# Altium schematic sheet ESP_32_devolpment_board_schematic.SchDoc
size 381 x 241 mm; SheetNumber: 1; SheetTotal: 1; Rule: UNIONINDEX=0|RULEKIND=Clearance|NETSCOPE=DifferentNets|LAYERKIND=SameLayer|NAME=Schematic Clearance Constraint|GAP=10mil|GENERICCLEARANCE=10mil|IGNOREPADTOPADCLEARANCEINFOOTPRINT=FALSE|OBJECTCLEARANCES= |UNIT=Metric; Rule: UNIONINDEX=0|RULEKIND=Clearance|NETSCOPE=DifferentNets|LAYERKIND=SameLayer|NAME=Schematic Clearance Constraint|GAP=10mil|GENERICCLEARANCE=10mil|IGNOREPADTOPADCLEARANCEINFOOTPRINT=FALSE|OBJECTCLEARANCES= |UNIT=Imperial
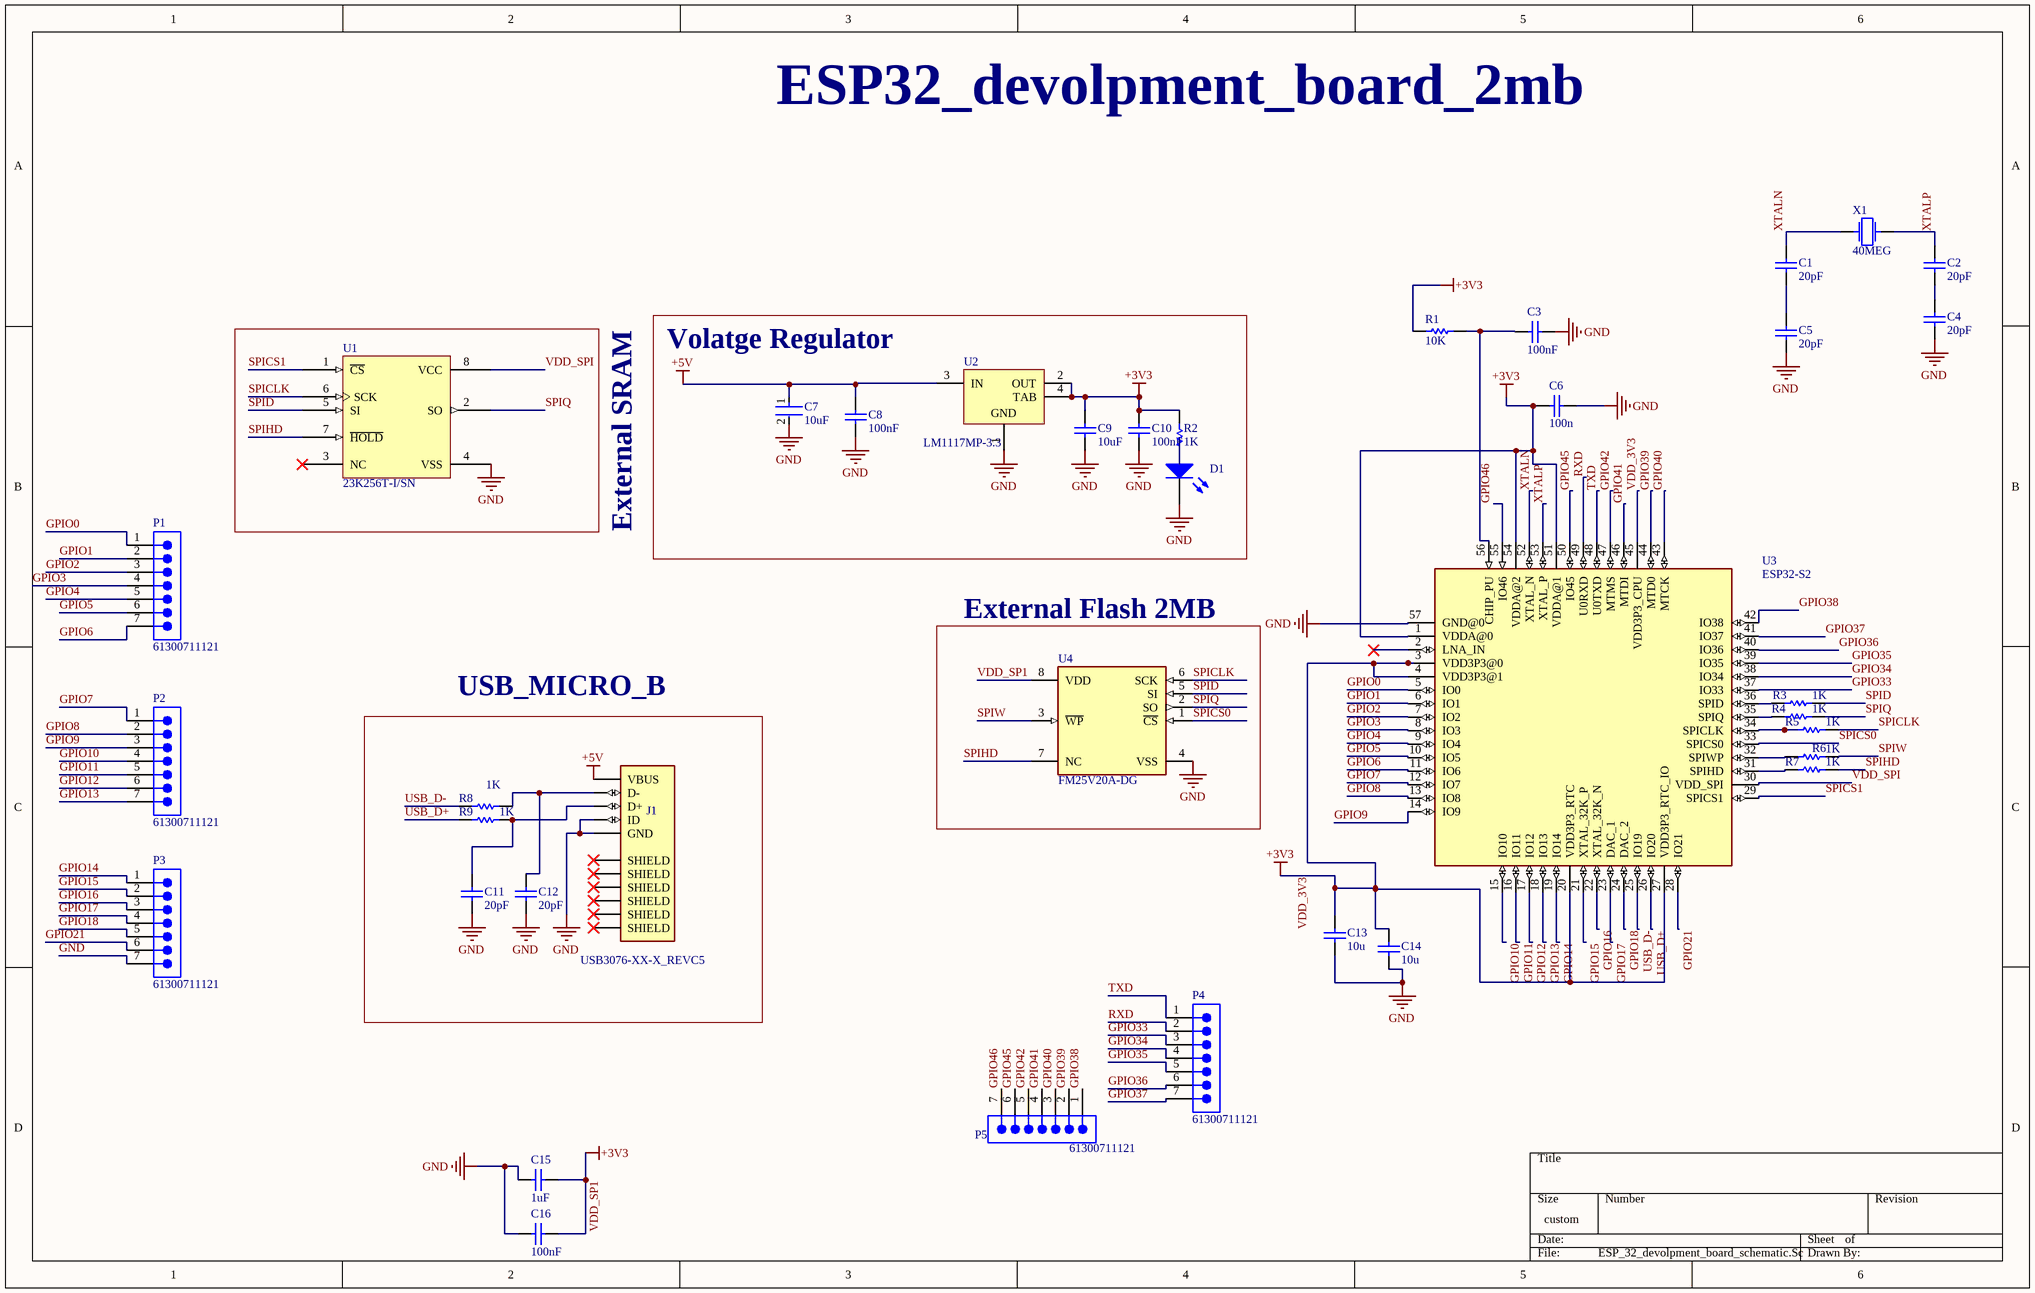
[diagram p0: ESP_32_devolpment_board_schematic.SchDoc]

## Parts
C1  value 20pF  [C Tantal A]  (hidden comment: Capacitor)
C2  value 20pF  [C Tantal A]  (hidden comment: Capacitor)
C3  value 100nF  [C Tantal A]  (hidden comment: Capacitor)
C4  value 20pF  [C Tantal A]  (hidden comment: Capacitor)
C5  value 20pF  [C Tantal A]  (hidden comment: Capacitor)
C6  value 100n  [C Tantal A]  (hidden comment: Capacitor)
C7  10uF  [FP-GRM188-0_1-e0_2_0_55-IPC_A]
C8  value 100nF  [C Tantal A]  (hidden comment: Capacitor)
C9  value 10uF  [C Tantal A]  (hidden comment: Capacitor)
C10  value 100nF  [C Tantal A]  (hidden comment: Capacitor)
C11  value 20pF  [C Tantal A]  (hidden comment: Capacitor)
C12  value 20pF  [C Tantal A]  (hidden comment: Capacitor)
C13  value 10u  [C Tantal A]  (hidden comment: Capacitor)
C14  value 10u  [C Tantal A]  (hidden comment: Capacitor)
C15  value 1uF  [C Tantal A]  (hidden comment: Capacitor)
C16  value 100nF  [C Tantal A]  (hidden comment: Capacitor)
D1  Light-Emitting Diode  [LED0805]  (value not drawn)
J1  USB3076-XX-X_REVC5  [GCT_USB3076-XX-X_REVC5]
P1  61300711121  [61300711121]
P2  61300711121  [61300711121]
P3  61300711121  [61300711121]
P4  61300711121  [61300711121]
P5  61300711121  [61300711121]
R1  value 10K  [R0805]  (hidden comment: Resistor)
R2  value 1K  [R0805]  (hidden comment: Resistor)
R3  value 1K  [R0805]  (hidden comment: Resistor)
R4  value 1K  [R0805]  (hidden comment: Resistor)
R5  value 1K  [R0805]  (hidden comment: Resistor)
R6  value 1K  [R0805]  (hidden comment: Resistor)
R7  value 1K  [R0805]  (hidden comment: Resistor)
R8  value 1K  [R0805]  (hidden comment: Resistor)
R9  value 1K  [R0805]  (hidden comment: Resistor)
U1  23K256T-I/SN  [SOIC-SN8_L]
U2  LM1117MP-3.3  [MP04A_M]
U3  ESP32-S2  [QFN40P700X700X90-57T400N]
U4  FM25V20A-DG  [FP-001-85579-IPC_C]
X1  F0: 40MEG  [Crystal_5x3.2mm]  (hidden comment: Crystal)

## Blocks framed on the sheet
Volatge Regulator: C7-C10 D1 R2 U2
External Flash 2MB: U4
USB_MICRO_B: C11 C12 J1 R8 R9

## Nets
+5V: C7.1 C8.1 J1.1(VBUS) U2.3(IN)
GND: C3.2 C4.2 C5.2 C6.2 C7.2 C8.2 C9.2 C10.2 C11.2 C12.2 C13.2 C14.2 C15.2 C16.2 D1.2(K) J1.4(ID) J1.5(GND) P3.7 U1.4(VSS) U2.1(GND) U3.57(GND@0) U4.4(VSS)
VDD_3V3: C6.1 C9.1 C10.1 C13.1 C14.1 C15.1 C16.1 R1.1 R2.1 U2.2(OUT) U2.4(TAB) U3.1(VDDA@0) U3.3(VDD3P3@0) U3.4(VDD3P3@1) U3.20(VDD3P3_RTC) U3.27(VDD3P3_RTC_IO) U3.45(VDD3P3_CPU) U3.51(VDDA@1) U3.54(VDDA@2) U4.8(VDD)  [also labelled +3V3, VDD_SP1]
GPIO0: P1.1 U3.5(IO0)
GPIO1: P1.2 U3.6(IO1)
GPIO2: P1.3 U3.7(IO2)
GPIO3: P1.4 U3.8(IO3)
GPIO4: P1.5 U3.9(IO4)
GPIO5: P1.6 U3.10(IO5)
GPIO6: P1.7 U3.11(IO6)
GPIO7: P2.1 U3.12(IO7)
GPIO8: P2.2 U3.13(IO8)
GPIO9: P2.3 U3.14(IO9)
GPIO10: P2.4 U3.15(IO10)
GPIO11: P2.5 U3.16(IO11)
GPIO12: P2.6 U3.17(IO12)
GPIO13: P2.7 U3.18(IO13)
GPIO14: P3.1 U3.19(IO14)
GPIO15: P3.2 U3.21(XTAL_32K_P)
GPIO16: P3.3 U3.22(XTAL_32K_N)
GPIO17: P3.4 U3.23(DAC_1)
GPIO18: P3.5 U3.24(DAC_2)
GPIO21: P3.6 U3.28(IO21)
GPIO33: P4.3 U3.37(IO33)
GPIO34: P4.4 U3.38(IO34)
GPIO35: P4.5 U3.39(IO35)
GPIO36: P4.6 U3.40(IO36)
GPIO37: P4.7 U3.41(IO37)
GPIO38: P5.1 U3.42(IO38)
GPIO39: P5.2 U3.44(MTD0)
GPIO40: P5.3 U3.43(MTCK)
GPIO41: P5.4 U3.46(MTDI)
GPIO42: P5.5 U3.47(MTMS)
GPIO45: P5.6 U3.50(IO45)
GPIO46: P5.7 U3.55(IO46)
RXD: P4.2 U3.49(U0RXD)
SPICLK: R5.2 U1.6(SCK) U4.6(SCK)
SPICS0: U3.33(SPICS0) U4.1(~{CS})
SPICS1: U1.1(~{CS}) U3.29(SPICS1)
SPID: R3.2 U1.5(SI) U4.5(SI)
SPIHD: R7.2 U1.7(~{HOLD}) U4.7(NC)
SPIQ: R4.2 U1.2(SO) U4.2(SO)
SPIW: R6.2 U4.3(~{WP})
TXD: P4.1 U3.48(U0TXD)
USB_D+: R9.1 U3.26(IO20)
USB_D-: R8.1 U3.25(IO19)
VDD_SPI: U1.8(VCC) U3.30(VDD_SPI)
XTALN: C1.1 U3.52(XTAL_N) X1.1
XTALP: C2.1 U3.53(XTAL_P) X1.2
NetC1_2: C1.2 C5.1
NetC2_2: C2.2 C4.1
NetC3_1: C3.1 R1.2 U3.56(CHIP_PU)
NetC11_1: C11.1 J1.3(D+) R9.2
NetC12_1: C12.1 J1.2(D-) R8.2
NetD1_1: D1.1(A) R2.2
NetR3_1: R3.1 U3.36(SPID)
NetR4_1: R4.1 U3.35(SPIQ)
NetR5_1: R5.1 U3.34(SPICLK)
NetR6_1: R6.1 U3.32(SPIWP)
NetR7_1: R7.1 U3.31(SPIHD)

Not connected (* = marked no-connect by the designer): J1 6(SHIELD)* 7(SHIELD)* 8(SHIELD)* 9(SHIELD)* 10(SHIELD)* 11(SHIELD)*; U1 3(NC)*; U3 2(LNA_IN)*

## Notes on the sheet
- ESP32_devolpment_board_2mb
- External SRAM

## Library data of the parts
C1-C6 C8-C16 = Capacitor: SimulationGenericComponent: True
C7 = CMP-2006-02792-2: Chip Multilayer Ceramic Capacitors for General Purpose, 0603, 10uF, X5R, 15%, 20%, 6.3V; Packaging: Tape and Reel; Voltage Rating (DC): 6.3V; Width: 0.031inch; Termination: SMD/SMT; Dielectric: X5R; Package Quantity: 4000; Voltage Rating: 6.3V; Capacitance: 10uF; Case/Package: 0603; Min Operating Temperature: -55°C; Voltage: 6.3V; Length: 1.6mm; Thickness: 0.035inch; Lead Free: Lead Free; Depth: 0.8mm; Case Code (Imperial): 0603; Max Operating Temperature: 85°C; Material: Ceramic; Height: 0.8mm; Tolerance: 20%; Mount: Surface Mount; REACH SVHC: No SVHC; Radiation Hardening: No; Case Code (Metric): 1608
D1 = LED: AF: 1; BV: 0; BV_MAX: 1e99; EG: 1.11; FC: 0.5; IBV: 0.001; IS: 1e-14; MJSW: 0.33; NTUN: 30; TNOM: 27; XTI: 3; SimulationGenericComponent: True; CJO: 0; CJP: 0; CTA: 0; CTP: 0; FCS: 0.5; FV_MAX: 1e99; IKF: 0; IKR: 0; ISR: 1e-14; JSW: 0; JTUN: 0; JTUNSW: 0; KEG: 1; KF: 0; LEVEL: 1; N: 1; NBV: 1; NR: 1; NS: 1; PHP: 1; RS: 0; TCV: 0; TLEV: 0; TLEVC: 0; TM1: 0; TM2: 0; TPB: 0; TPHP: 0; TRS: 0; TRS2: 0; TT: 0; TTT1: 0; TTT2: 0; VJ: 1; XTITUN: 3
J1 = USB3076-XX-X_REVC5: USB - micro B USB 2.0 Receptacle Connector 5 Position Surface Mount, Right Angle; Through Hole, 2.35mm profile, 5 Pins, Horizontal, Bottom mount; MP: USB3076-30-A; MF: Global Connector Technology; SnapEDA_Link: https://www.snapeda.com/parts/USB3076-30-A/Global+Connector+Technology/view-part/?ref=snap; Package: None; Check_prices: https://www.snapeda.com/parts/USB3076-30-A/Global+Connector+Technology/view-part/?ref=eda; Purchase-URL: https://pricing.snapeda.com/search/part/USB3076-30-A/?ref=eda; Price: None; Value: *; Availability: In Stock
P1-P5 = CMP-1502-01074-3: NexarPartId: 32855531; Current Rating: 3A; Number of Positions: 7; Connector Type: Male Pin; Gender: Male; Operating Supply Voltage: 250V; Pitch: 2.54mm; Contact Resistance: 20mΩ; Contact Material: Copper; Contact Plating: Gold; Contact Mating Length: 5.9944mm; Mount: Through Hole; Termination: Solder; Number of Pins: 7; Color: Black; Packaging: Bulk; REACH SVHC: Unknown; Orientation: Vertical; Lead Pitch: 2.54mm; RoHS: Compliant; Number of Rows: 1; Number of Contacts: 7
R1-R9 = Resistor: TC1: 0; SimulationGenericComponent: True; TC2: 0
U1 = CMP-0163-00013-1: 256K, 32768x8-bit, 3.6V SPI Serial SRAM, 8-Pin SOIC 3.9mm, Industrial TemperatureTape and Reel; PackageDescription: 8-Lead Plastic Small Outline (SN) - Narrow, 3.90mm Body [SOIC]; PackageVersion: revBB, Aug-2009; PackageReference: SOIC-SN8; Code_IPC: SOIC127P600-8; Code_JEDEC: MS-012; DatasheetVersion: revD, Apr-2009
U2 = CMP-0062-01658-3: 800mA Low-Dropout Linear Regulator, 4-pin SOT-223; Manufacturer: National Semiconductor; High-Reliability: Y; PackageTopMarking: XYTT*N05A; PowerWise: N; CompType: LDO IC; PackageReference: MP04A; Code_IPC: SOT223-4; Code_JEDEC: TO-261-AA; PinCount: 4; ComponentLink3Description: LM1117 Web Page; PackageVersion: revB, Apr-2003; RoHS: N; ComponentLink4URL: http://www.national.com/packaging/folders/mp04a.html; ComponentLink2URL: http://www.national.com/ds/LM/LM1117.pdf; ComponentLink1URL: http://www.national.com/; ComponentLink1Description: Manufacturer URL; RevisionNote: SCH symbol layout adjusted; DatasheetVersion: Apr-2006; PackageDescription: Molded SOT-223, 6.50 x 3.56 x 1.6mm Body, 4 Lead, 2.3mm Pitch; PartNumber: LM1117MP-3.3; ComponentLink4Description: MP04A Package Page; ComponentLink2Description: LM1117 Datasheet; ComponentLink3URL: http://www.national.com/pf/LM/LM1117.html
U3 = ESP32-S2: WiFi 802.11b/g/n Transceiver Module 2.412GHz ~ 2.484GHz Antenna Not Included Surface Mount; MF: Espressif Systems; SnapEDA_Link: https://www.snapeda.com/parts/ESP32-S2/Espressif+Systems/view-part/?ref=snap; Package: QFN-56 Espressif Systems; Value: *; MP: ESP32-S2; Check_prices: https://www.snapeda.com/parts/ESP32-S2/Espressif+Systems/view-part/?ref=eda
U4 = CMP-12949-000003-1: IC FRAM 2M SPI 40MHZ 8TDFN; Manufacturer: Cypress Semiconductor; Nominal Supply Current: 2.4mA; Access Time: 9ns; Min Supply Voltage: 2V; Max Supply Voltage: 3.6V; Memory Type: RAM; Standoff Height: 0mm; Memory Size: 2Mbits; Automotive: No; Device Class L1: Integrated Circuits (ICs); Temperature Range Low: -40°C; Height: 0.8mm; RoHS: TRUE; Octopart: https://octopart.com/fm25v20a-dg-cypress+semiconductor-50333481; Mouser Description: F-RAM 2Mb, 40Mhz, 256K x 8 SPI FRAM; Ambient Temperature Range High: +85°C; ComponentLink2URL: https://www.cypress.com/file/141396/download; Device Class L2: Memory; Ambient Temperature Range Low: -40°C; Digikey Description: IC FRAM 2M SPI 40MHZ 8TDFN; Manufacturer Part Number: FM25V20A-DG; Lead Free: Yes; Frequency: 40MHz; Package: 001-85579; Temperature Range High: +85°C; Interface: SPI; Temperature: -40°C to +85°C; Device Class L3: RAM; Ipc Land Pattern Name: DFN500X600X75-8; Category: IC; ComponentLink2Description: Datasheet
X1 = Crystal: R: 500; Q: 50K; SimulationGenericComponent: True